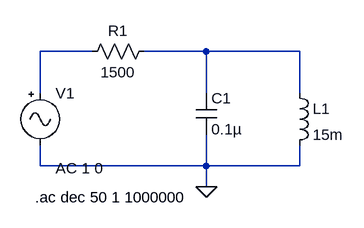
[diagram p0: schematic P1c.asc]
P1c.asc, the LTspice schematic file:
Version 4.1
SHEET 1 880 680
WIRE 160 96 80 96
WIRE 336 96 240 96
WIRE 480 96 336 96
WIRE 80 160 80 96
WIRE 336 160 336 96
WIRE 480 160 480 96
WIRE 80 272 80 240
WIRE 336 272 336 224
WIRE 336 272 80 272
WIRE 480 272 480 240
WIRE 480 272 336 272
WIRE 336 304 336 272
FLAG 336 304 0
SYMBOL Misc\\signal 80 144 R0
WINDOW 123 24 132 Left 2
WINDOW 39 0 0 Left 0
SYMATTR InstName V1
SYMATTR Value ""
SYMATTR Value2 AC 1 0
SYMBOL res 256 80 R90
WINDOW 0 0 56 VBottom 2
WINDOW 3 32 56 VTop 2
SYMATTR InstName R1
SYMATTR Value 1500
SYMBOL cap 320 160 R0
SYMATTR InstName C1
SYMATTR Value 0.1µ
SYMBOL ind 464 144 R0
SYMATTR InstName L1
SYMATTR Value 15m
SYMATTR SpiceLine Rser=1m
TEXT 72 320 Left 2 !.ac dec 50 1 1000000

The netlist it stands for:
* P1c.asc
V1 N001 0 AC 1 0
R1 N002 N001 1500
C1 N002 0 0.1µ
L1 N002 0 15m Rser=1m
.ac dec 50 1 1000000
.backanno
.end